# Altium schematic sheet Inductor15uH.schdoc
size 49 x 26 mm
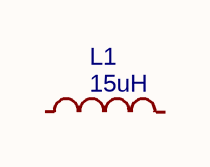
[diagram p0: Inductor15uH.schdoc]

## Parts
L1  15uH  [IND-SMD_L11.5-W10.5_MWSA1004]

## Nets

Not connected (* = marked no-connect by the designer): L1 1 2

## Library data of the parts
L1 = 15uH: BOM_Manufacturer: Sunlord; BOM_Manufacturer Part: MWSA1004-150MT; nameAlias: Inductance; Contributor: LCSC; BOM_Supplier: LCSC; BOM_Supplier Part: C151872; BOM_JLCPCB Part Class: Extended Part; spicePre: L; spiceSymbolName: MWSA1004-150MT